# EAGLE schematic XR3403D_test (EAGLE 9.6.1)
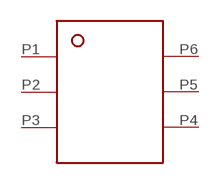
[diagram p0: schematic, sheet 1]

## Parts
U$1  XR3403D  [XR3403D]
Unconnected: U$1.P1 U$1.P2 U$1.P3 U$1.P4 U$1.P5 U$1.P6

## Library data of the parts
U$1 = XR3403D:XR3403D